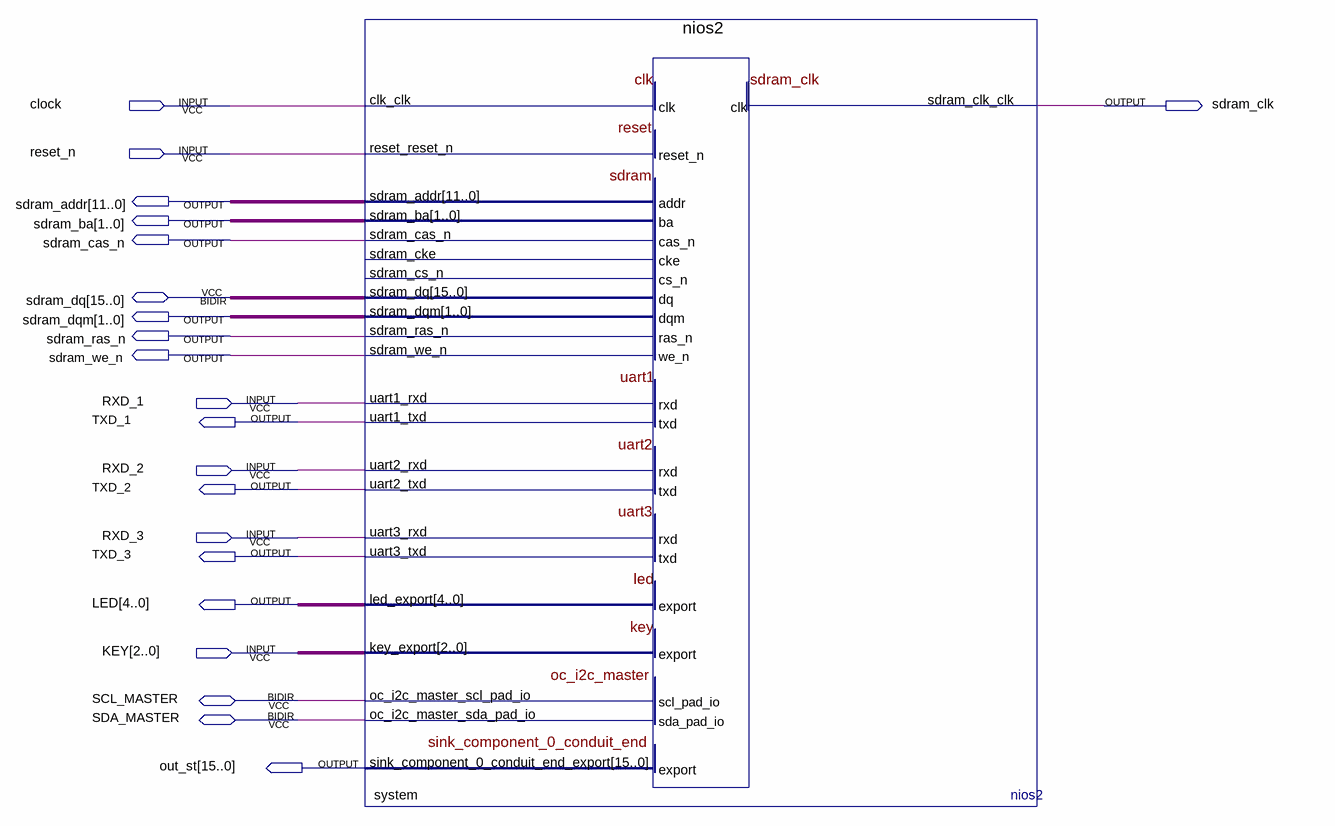
[diagram p0: schematic sheet]
// Quartus schematic EP2C8_Qsys.bdf as structural Verilog: 1 symbols, 21 pins
module EP2C8_Qsys (
  input  clock,
  input  reset_n,
  input  RXD_1,
  input  RXD_2,
  input  RXD_3,
  input  [2:0] KEY,
  inout  [15:0] sdram_dq,
  inout  SCL_MASTER,
  inout  SDA_MASTER,
  output sdram_clk,
  output [11:0] sdram_addr,
  output [1:0] sdram_ba,
  output sdram_cas_n,
  output [1:0] sdram_dqm,
  output sdram_ras_n,
  output sdram_we_n,
  output TXD_1,
  output TXD_2,
  output TXD_3,
  output [4:0] LED,
  output [15:0] out_st
);

  nios2 system (
    .clk_clk(clock), .reset_reset_n(reset_n), .uart1_rxd(RXD_1), .uart2_rxd(RXD_2), .uart3_rxd(RXD_3),
    .key_export(KEY), .sdram_addr(sdram_addr), .sdram_ba(sdram_ba), .sdram_cas_n(sdram_cas_n),
    .sdram_dqm(sdram_dqm), .sdram_ras_n(sdram_ras_n), .sdram_we_n(sdram_we_n), .sdram_clk_clk(sdram_clk),
    .uart1_txd(TXD_1), .uart2_txd(TXD_2), .uart3_txd(TXD_3), .led_export(LED),
    .sink_component_0_conduit_end_export(out_st), .sdram_dq(sdram_dq), .oc_i2c_master_scl_pad_io(SCL_MASTER),
    .oc_i2c_master_sda_pad_io(SDA_MASTER));  // open: sdram_cke, sdram_cs_n
endmodule
